# EasyEDA Pro project CALU_BMS_V1.3.0.0.epro, board PCB2
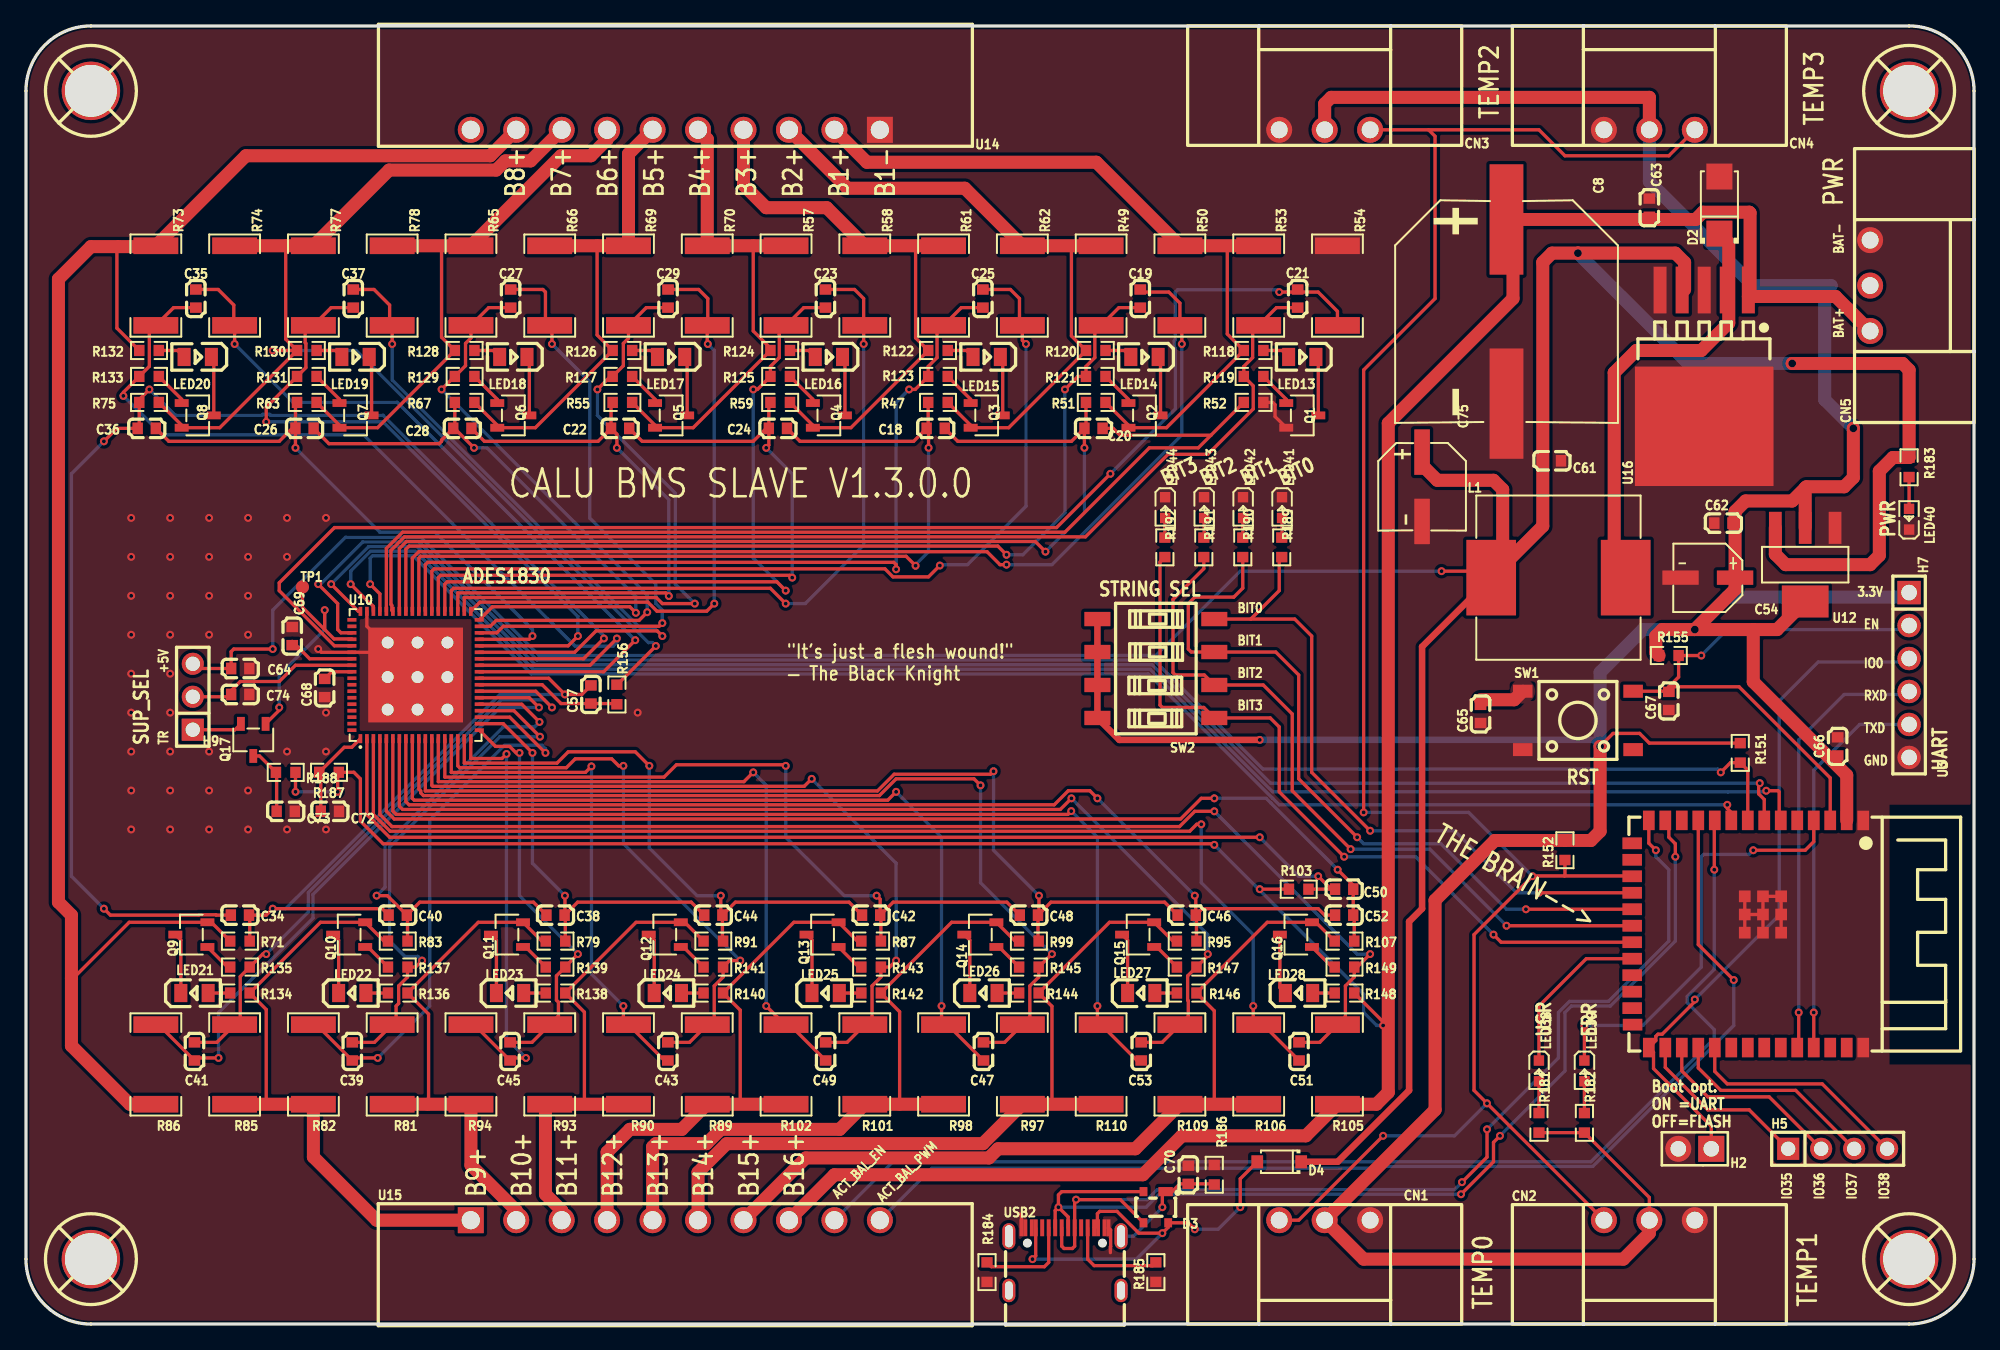
[diagram p19: board, top side]
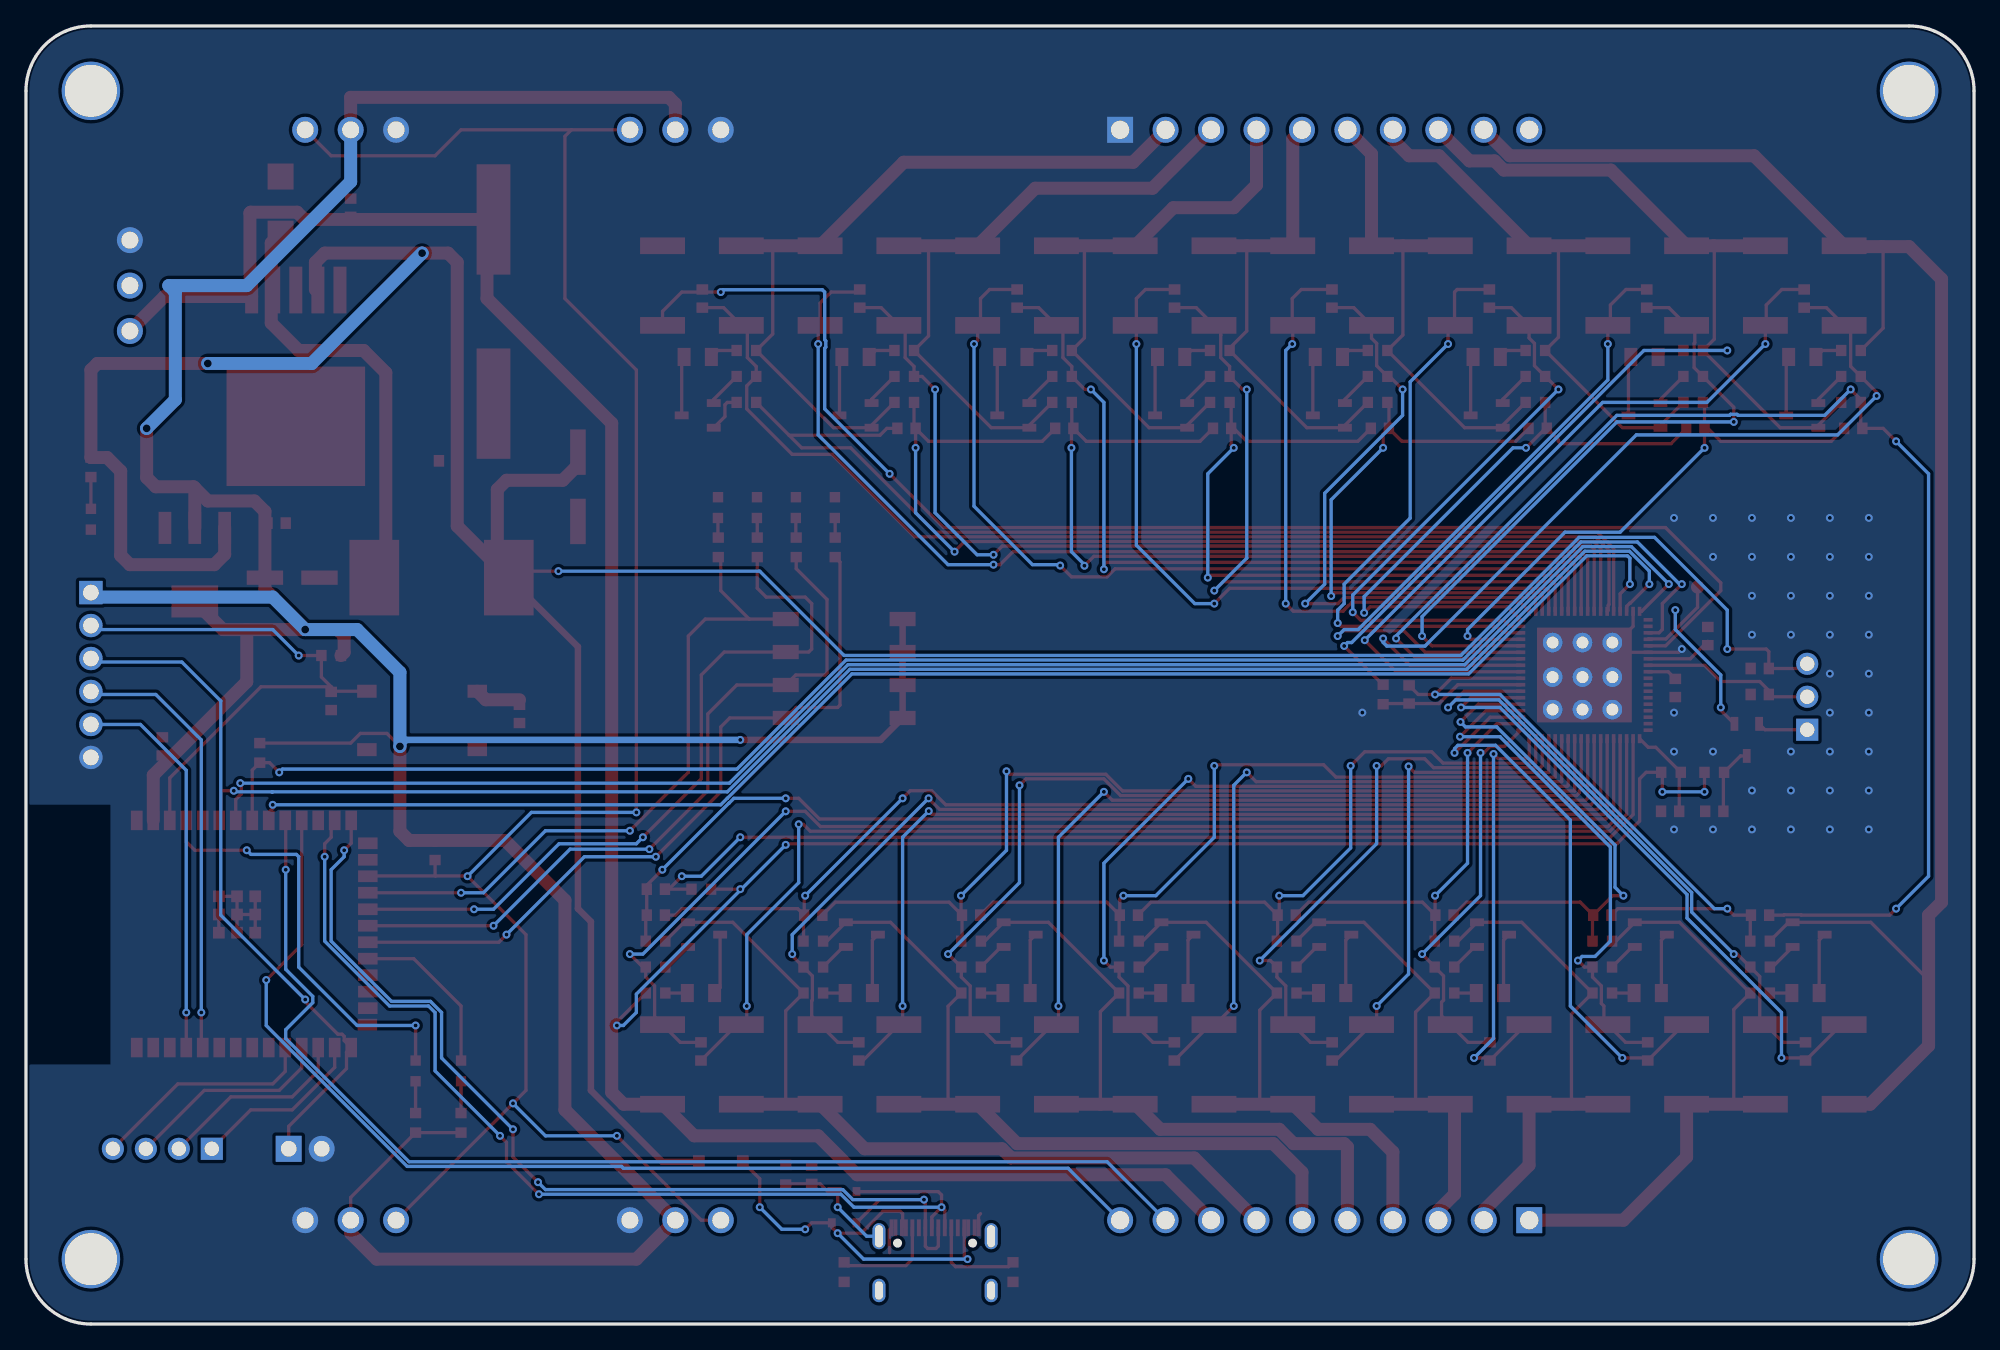
[diagram p20: board, bottom side, seen from below]

Outline 150 x 100 mm; copper layers: Top Layer, Bottom Layer. Coordinates in mm from the lower left corner of the outline.
Outline path: 0,95 0,5 arc(1.46,1.46) 5,0 145,0 arc(148.54,1.46) 150,5 150,95 arc(148.54,98.54) 145,100 5,100 arc(1.46,98.54) 0,95
Stack: Top Layer 0.035mm / Dielectric1 1.51mm FR4 er 4.5 / Bottom Layer 0.035mm

## Design rules (mm)
template: Custom Config
spacing copperThickness1oz (default): track to track 0.102, other pairs 0.152 to 0.3
spacing copperThickness2oz: track to track 0.203, other pairs 0.152 to 0.3
track width copperThickness1oz (default): min 0.127, default 0.254, max 2.54
track width copperThickness2oz: min 0.203, default 0.254, max 2.54
differential pair differentialPair (default): width min 0.127, default 0.254, max 2.54; gap min 0.152, default 0.152
via viaSize (default): diameter min 0.5, default 0.61, max 10; hole min 0.3, default 0.305, max 6.3

## Placement (name value [footprint] x y rotation side)
C8  470uF  [CAP-SMD_BD16.0-L17.0-W17.0-FD-LS18.0]  114 78 270 top
C18  10nF  [C0603]  70.05 69 180 top
C19  100nF  [C0603]  85.8 79 270 top
C20  10nF  [C0603]  82.2 69 180 top
C21  100nF  [C0603]  97.92 79 270 top
C22  10nF  [C0603]  45.75 69 180 top
C23  100nF  [C0603]  61.56 79 270 top
C24  10nF  [C0603]  57.9 69 180 top
C25  100nF  [C0603]  73.68 79 270 top
C26  10nF  [C0603]  21.45 69 180 top
C27  100nF  [C0603]  37.32 79 270 top
C28  10nF  [C0603]  33.6 69 180 top
C29  100nF  [C0603]  49.44 79 270 top
C34  10nF  [C0603]  16.47 31.5 0 top
C35  100nF  [C0603]  13.08 79 270 top
C36  10nF  [C0603]  9.3 69 180 top
C37  100nF  [C0603]  25.2 79 270 top
C38  10nF  [C0603]  40.78 31.5 0 top
C39  100nF  [C0603]  25.12 21 90 top
C40  10nF  [C0603]  28.62 31.5 0 top
C41  100nF  [C0603]  12.97 21 90 top
C42  10nF  [C0603]  65.07 31.5 0 top
C43  100nF  [C0603]  49.42 21 90 top
C44  10nF  [C0603]  52.92 31.5 0 top
C45  100nF  [C0603]  37.28 21 90 top
C46  10nF  [C0603]  89.38 31.5 0 top
C47  100nF  [C0603]  73.72 21 90 top
C48  10nF  [C0603]  77.22 31.5 0 top
C49  100nF  [C0603]  61.57 21 90 top
C50  10nF  [C0603]  101.5 33.5 180 top
C51  100nF  [C0603]  98.03 21 90 top
C52  10nF  [C0603]  101.5 31.5 0 top
C53  100nF  [C0603]  85.88 21 90 top
C54  22uF  [CAP-SMD_BD5.0-L5.3-W5.3-LS6.0-FD]  129.5 57.5 180 top
C57  10nF  [C0603]  43.5 48.5 270 top
C61  100nF  [C0603]  117.5 66.5 180 top
C62  100nF  [C0603]  130.7 61.7 0 top
C63  100nF  [C0603]  125 86 270 top
C64  100nF  [C0603]  16.5 50.5 180 top
C65  100nF  [C0603]  112 47 90 top
C66  100nF  [C0603]  139.5 44.5 270 top
C67  1uF  [C0603]  126.5 48 90 top
C68  1uF  [C0603]  23 49 90 top
C69  1uF  [C0603]  20.5 53 270 top
C70  4.7nF  [C0603]  89.5 11.5 90 top
C72  10nF  [C0603]  23.4 39.5 180 top
C73  10nF  [C0603]  20 39.5 180 top
C74  1uF  [C0603]  16.5 48.5 180 top
C75  470uF  [CAP-SMD_BD6.3-L6.6-W6.6-LS7.6-RD]  107.5 64.5 270 top
CN1  TEMP0  [CONN-TH_3P-P3.50_MAX_MX15EDGRM-3.5-GN01-03P-CU-A]  100 8 0 top
CN2  TEMP1  [CONN-TH_3P-P3.50_MAX_MX15EDGRM-3.5-GN01-03P-CU-A]  125 8 0 top
CN3  TEMP2  [CONN-TH_3P-P3.50_MAX_MX15EDGRM-3.5-GN01-03P-CU-A]  100 92 180 top
CN4  TEMP3  [CONN-TH_3P-P3.50_MAX_MX15EDGRM-3.5-GN01-03P-CU-A]  125 92 180 top
CN5  PWR  [CONN-TH_3P-P3.50_MAX_MX15EDGRM-3.5-GN01-03P-CU-A]  142 80 90 top
D2  SS34  [SMA_L4.3-W2.6-LS5.2-RD]  130.39 86.2 90 top
D3  PRTR5V0U2X  [SOT-143_L2.9-W1.3-P1.92-LS2.3-BL]  87 9 180 top
D4  PMEG6020AELRX  [SOD-123_L2.6-W1.7-LS3.5-RD]  96.5 12.5 180 top
H2  Boot Opt.  [HDR-TH_2P-P2.54-V-M]  128.5 13.5 180 top
H5  IO_B1  [HDR-TH_4P-P2.54-V-M]  139.5 13.5 0 top
H7  PROG  [HDR-TH_6P-P2.54-V-M-1]  145 50 270 top
H9  ADES_SUP  [HDR-TH_3P-P2.54-V-M]  12.84 48.32 90 top
L1  68uH  [IND-SMD_L12.5-W12.5]  118 57.5 0 top
LED13  NCD0805G1  [LED0805-R-RD]  98.28 74.5 180 top
LED14  NCD0805G1  [LED0805-R-RD]  86.12 74.5 180 top
LED15  NCD0805G1  [LED0805-R-RD]  73.97 74.5 180 top
LED16  NCD0805G1  [LED0805-R-RD]  61.82 74.5 180 top
LED17  NCD0805G1  [LED0805-R-RD]  49.67 74.5 180 top
LED18  NCD0805G1  [LED0805-R-RD]  37.53 74.5 180 top
LED19  NCD0805G1  [LED0805-R-RD]  25.38 74.5 180 top
LED20  NCD0805G1  [LED0805-R-RD]  13.22 74.5 180 top
LED21  NCD0805G1  [LED0805-R-RD]  12.97 25.5 0 top
LED22  NCD0805G1  [LED0805-R-RD]  25.12 25.5 0 top
LED23  NCD0805G1  [LED0805-R-RD]  37.28 25.5 0 top
LED24  NCD0805G1  [LED0805-R-RD]  49.42 25.5 0 top
LED25  NCD0805G1  [LED0805-R-RD]  61.57 25.5 0 top
LED26  NCD0805G1  [LED0805-R-RD]  73.72 25.5 0 top
LED27  NCD0805G1  [LED0805-R-RD]  85.88 25.5 0 top
LED28  NCD0805G1  [LED0805-R-RD]  98.03 25.5 0 top
LED38  LED_USR  [LED0603-RD-YELLOW]  116.5 19.5 270 top
LED39  LED_ERR  [LED0603-RD_RED]  120 19.5 270 top
LED40  LED_USR  [LED0603-RD-YELLOW]  145 62 90 top
LED41  STR_SEL_0  [LED0603-RD-YELLOW]  96.72 62.9 270 top
LED42  STR_SEL_1  [LED0603-RD-YELLOW]  93.72 62.9 270 top
LED43  STR_SEL_2  [LED0603-RD-YELLOW]  90.72 62.9 270 top
LED44  STR_SEL_3  [LED0603-RD-YELLOW]  87.72 62.9 270 top
NOREF  -  [Pad_e13402]  27.85 49.84 0 top
NOREF#2  -  [Pad_e13398]  30.15 52.5 0 top
NOREF#3  -  [Pad_e13400]  32.45 49.84 0 top
NOREF#4  -  [Pad_e13404]  30.15 47.34 0 top
NOREF#5  -  [Pad_e13403]  32.45 47.34 0 top
NOREF#6  -  [Pad_e13405]  27.85 47.34 0 top
NOREF#7  -  [Pad_e13389]  27.85 52.5 0 top
NOREF#8  -  [Pad_e13401]  30.15 49.84 0 top
NOREF#9  -  [Pad_e13399]  32.45 52.5 0 top
Q1  S8050  [SOT-23-3_L2.9-W1.6-P1.90-LS2.8-BR]  98.28 70 180 top
Q2  S8050  [SOT-23-3_L2.9-W1.6-P1.90-LS2.8-BR]  86.12 70 180 top
Q3  S8050  [SOT-23-3_L2.9-W1.6-P1.90-LS2.8-BR]  73.97 70 180 top
Q4  S8050  [SOT-23-3_L2.9-W1.6-P1.90-LS2.8-BR]  61.82 70 180 top
Q5  S8050  [SOT-23-3_L2.9-W1.6-P1.90-LS2.8-BR]  49.67 70 180 top
Q6  S8050  [SOT-23-3_L2.9-W1.6-P1.90-LS2.8-BR]  37.53 70 180 top
Q7  S8050  [SOT-23-3_L2.9-W1.6-P1.90-LS2.8-BR]  25.38 70 180 top
Q8  S8050  [SOT-23-3_L2.9-W1.6-P1.90-LS2.8-BR]  13.22 70 180 top
Q9  S8050  [SOT-23-3_L2.9-W1.6-P1.90-LS2.8-BR]  12.74 30 0 top
Q10  S8050  [SOT-23-3_L2.9-W1.6-P1.90-LS2.8-BR]  24.89 30 0 top
Q11  S8050  [SOT-23-3_L2.9-W1.6-P1.90-LS2.8-BR]  37.04 30 0 top
Q12  S8050  [SOT-23-3_L2.9-W1.6-P1.90-LS2.8-BR]  49.19 30 0 top
Q13  S8050  [SOT-23-3_L2.9-W1.6-P1.90-LS2.8-BR]  61.34 30 0 top
Q14  S8050  [SOT-23-3_L2.9-W1.6-P1.90-LS2.8-BR]  73.49 30 0 top
Q15  S8050  [SOT-23-3_L2.9-W1.6-P1.90-LS2.8-BR]  85.64 30 0 top
Q16  S8050  [SOT-23-3_L2.9-W1.6-P1.90-LS2.8-BR]  97.79 30 0 top
Q17  S8050  [SOT-23-3_L2.9-W1.6-P1.90-LS2.8-BR]  17.5 45 90 top
R47  200Ω  [R0603]  70.22 71 180 top
R49  10Ω  [R2512]  82.79 80 270 top
R50  10Ω  [R2512]  88.85 80 270 top
R51  200Ω  [R0603]  82.38 71 180 top
R52  200Ω  [R0603]  94.53 71 180 top
R53  10Ω  [R2512]  94.92 80 270 top
R54  10Ω  [R2512]  100.98 80 270 top
R55  200Ω  [R0603]  45.92 71 180 top
R57  10Ω  [R2512]  58.52 80 270 top
R58  10Ω  [R2512]  64.59 80 270 top
R59  200Ω  [R0603]  58.07 71 180 top
R61  10Ω  [R2512]  70.66 80 270 top
R62  10Ω  [R2512]  76.72 80 270 top
R63  200Ω  [R0603]  21.62 71 180 top
R65  10Ω  [R2512]  34.26 80 270 top
R66  10Ω  [R2512]  40.33 80 270 top
R67  200Ω  [R0603]  33.78 71 180 top
R69  10Ω  [R2512]  46.39 80 270 top
R70  10Ω  [R2512]  52.46 80 270 top
R71  200Ω  [R0603]  16.47 29.5 0 top
R73  10Ω  [R2512]  10 80 270 top
R74  10Ω  [R2512]  16.07 80 270 top
R75  200Ω  [R0603]  9.47 71 180 top
R77  10Ω  [R2512]  22.13 80 270 top
R78  10Ω  [R2512]  28.2 80 270 top
R79  200Ω  [R0603]  40.78 29.5 0 top
R81  10Ω  [R2512]  28.2 20 90 top
R82  10Ω  [R2512]  22.13 20 90 top
R83  200Ω  [R0603]  28.62 29.5 0 top
R85  10Ω  [R2512]  16.07 20 90 top
R86  10Ω  [R2512]  10 20 90 top
R87  200Ω  [R0603]  65.07 29.5 0 top
R89  10Ω  [R2512]  52.46 20 90 top
R90  10Ω  [R2512]  46.39 20 90 top
R91  200Ω  [R0603]  52.92 29.5 0 top
R93  10Ω  [R2512]  40.33 20 90 top
R94  10Ω  [R2512]  34.26 20 90 top
R95  200Ω  [R0603]  89.38 29.5 0 top
R97  10Ω  [R2512]  76.72 20 90 top
R98  10Ω  [R2512]  70.66 20 90 top
R99  200Ω  [R0603]  77.22 29.5 0 top
R101  10Ω  [R2512]  64.59 20 90 top
R102  10Ω  [R2512]  58.52 20 90 top
R103  200Ω  [R0603]  98 33.5 0 top
R105  10Ω  [R2512]  100.98 20 90 top
R106  10Ω  [R2512]  94.92 20 90 top
R107  200Ω  [R0603]  101.53 29.5 0 top
R109  10Ω  [R2512]  88.85 20 90 top
R110  10Ω  [R2512]  82.79 20 90 top
R118  68Ω  [R0603]  94.53 75 180 top
R119  1kΩ  [R0603]  94.53 73 180 top
R120  68Ω  [R0603]  82.38 75 180 top
R121  1kΩ  [R0603]  82.38 73 180 top
R122  68Ω  [R0603]  70.22 75 180 top
R123  1kΩ  [R0603]  70.22 73 180 top
R124  68Ω  [R0603]  58.07 75 180 top
R125  1kΩ  [R0603]  58.07 73 180 top
R126  68Ω  [R0603]  45.92 75 180 top
R127  1kΩ  [R0603]  45.92 73 180 top
R128  68Ω  [R0603]  33.78 75 180 top
R129  1kΩ  [R0603]  33.78 73 180 top
R130  68Ω  [R0603]  21.62 75 180 top
R131  1kΩ  [R0603]  21.62 73 180 top
R132  68Ω  [R0603]  9.47 75 180 top
R133  1kΩ  [R0603]  9.47 73 180 top
R134  68Ω  [R0603]  16.47 25.5 0 top
R135  1kΩ  [R0603]  16.47 27.5 0 top
R136  68Ω  [R0603]  28.62 25.5 0 top
R137  1kΩ  [R0603]  28.62 27.5 0 top
R138  68Ω  [R0603]  40.78 25.5 0 top
R139  1kΩ  [R0603]  40.78 27.5 0 top
R140  68Ω  [R0603]  52.92 25.5 0 top
R141  1kΩ  [R0603]  52.92 27.5 0 top
R142  68Ω  [R0603]  65.07 25.5 0 top
R143  1kΩ  [R0603]  65.07 27.5 0 top
R144  68Ω  [R0603]  77.22 25.5 0 top
R145  1kΩ  [R0603]  77.22 27.5 0 top
R146  68Ω  [R0603]  89.38 25.5 0 top
R147  1kΩ  [R0603]  89.38 27.5 0 top
R148  68Ω  [R0603]  101.53 25.5 0 top
R149  1kΩ  [R0603]  101.53 27.5 0 top
R151  1kΩ  [R0603]  132 44 90 top
R152  4.7kΩ  [R0603]  118.5 36.5 90 top
R155  10kΩ  [R0603]  126.5 51.5 180 top
R156  200Ω  [R0603]  45.5 48.5 270 top
R181  390Ω  [R0603]  116.5 15.5 270 top
R182  820Ω  [R0603]  120 15.5 270 top
R183  1.2kΩ  [R0603]  145 66 90 top
R184  5.1kΩ  [R0603]  74 4 90 top
R185  5.1kΩ  [R0603]  87 4 90 top
R186  1MΩ  [R0603]  91.5 11.5 270 top
R187  1kΩ  [R0603]  23.33 42.51 0 top
R188  330Ω  [R0603]  20 42.5 180 top
R189  390Ω  [R0603]  96.69 59.83 270 top
R190  390Ω  [R0603]  93.69 59.83 270 top
R191  390Ω  [R0603]  90.69 59.83 270 top
R192  390Ω  [R0603]  87.69 59.83 270 top
SCREW1  -  [Screw-Hole-M4]  5 5 0 top
SCREW2  -  [Screw-Hole-M4]  145 5 0 top
SCREW3  -  [Screw-Hole-M4]  145 95 0 top
SCREW4  -  [Screw-Hole-M4]  5 95 0 top
SW1  Reboot  [SW-SMD_4P-L6.0-W6.0-P4.50-LS9.0-H2.5]  119.5 46.5 0 top
SW2  STR_NR  [SW-SMD_8P-L10.2-W6.2-P2.54-LS9.4]  87 50.5 0 top
TP1  -  [Test-Point-0.5mm]  21.29 56.78 0 top
U3  ESP32-S3-WROOM-1-N8R8  [WIRELM-SMD_ESP32-S3-WROOM-1]  132.57 30.05 270 top
U10  ADES1830CCSZ  [LFCSP-72_L10.0-W10.0-P0.50-BL-EP7.3]  30 50 0 top
U12  AMS1117-3.3  [SOT-223-4_L6.5-W3.5-P2.30-LS7.0-BR]  137 58.5 90 top
U14  BATT_0  [CONN-TH_10P-P3.50_MX15EDGRM-3.5-10P-GN01-CU-A]  50 92 180 top
U15  BATT_1  [CONN-TH_10P-P3.50_MX15EDGRM-3.5-10P-GN01-CU-A]  50 8 0 top
U16  LM2596HVS-5.0/TR  [TO-263-5_L10.2-W8.9-P1.70-LS15.2-BR]  129.22 74.41 90 top
USB2  -  [USB-C-SMD_KH-TYPE-C-16P]  80 5 0 top

## Footprints (pads in the part's own frame, mm; a bottom-side part is the same pattern mirrored in y, then rotated)
C0603
  rect 0.8x0.9 smd: 1(-0.7,0) 2(0.7,0)
CAP-SMD_BD5.0-L5.3-W5.3-LS6.0-FD
  rect 2.8x1.1 smd: 1(-2.1,0) 2(2.1,0)
CAP-SMD_BD6.3-L6.6-W6.6-LS7.6-RD
  rect 3.5x1.2 smd: 1(-2.67,0) 2(2.67,0)
CAP-SMD_BD16.0-L17.0-W17.0-FD-LS18.0
  rect 8.5x2.6 smd: 1(-7.093,0) 2(7.093,0)
CONN-TH_3P-P3.50_MAX_MX15EDGRM-3.5-GN01-03P-CU-A
  round 2 hole 1.3: 1(-3.5,0) 2(0,0) 3(3.5,0)
CONN-TH_10P-P3.50_MX15EDGRM-3.5-10P-GN01-CU-A
  rect 2x2 hole 1.4: 1(-15.75,0.001)
  round 2 hole 1.4: 2(-12.25,-0.001) 3(-8.75,-0.001) 4(-5.25,-0.001) 5(-1.75,-0.001) 6(1.75,-0.001) 7(5.25,-0.001) 8(8.75,-0.001) 9(12.25,-0.001) 10(15.75,-0.001)
HDR-TH_2P-P2.54-V-M
  rect 2x2 hole 1.2: 1(-1.27,0)
  round 2 hole 1.2: 2(1.27,0)
HDR-TH_3P-P2.54-V-M
  rect 1.7x1.7 hole 1.1: 1(-2.54,0)
  round 1.7 hole 1.1: 2(0,0) 3(2.54,0)
HDR-TH_4P-P2.54-V-M
  rect 1.7x1.7 hole 1.1: 1(-3.81,0)
  round 1.7 hole 1.1: 2(-1.27,0) 3(1.27,0) 4(3.81,0)
HDR-TH_6P-P2.54-V-M-1
  rect 1.8x1.8 hole 1.2: 1(-6.35,0)
  round 1.8 hole 1.2: 2(-3.81,0) 3(-1.27,0) 4(1.27,0) 5(3.81,0) 6(6.35,0)
IND-SMD_L12.5-W12.5
  rect 3.824x5.82 smd: 1(5.178,0) 2(-5.178,0)
LED0603-RD-YELLOW
  rect 0.8x0.8 smd: 1(-0.799,-0.004) 2(0.799,0.004)
LED0603-RD_RED
  rect 0.8x0.8 smd: 1(-0.799,-0.004) 2(0.799,0.004)
LED0805-R-RD
  rect 1x1.399 smd: 1(1.05,0) 2(-1.05,0)
LFCSP-72_L10.0-W10.0-P0.50-BL-EP7.3
  rect 0.28x0.697 smd: 1(-4.25,-4.904) 2(-3.75,-4.904) 3(-3.25,-4.904) 4(-2.75,-4.904) 5(-2.25,-4.904) 6(-1.75,-4.904) 7(-1.25,-4.904) 8(-0.75,-4.904) 9(-0.25,-4.904) 10(0.25,-4.904) 11(0.75,-4.904) 12(1.25,-4.904) 13(1.75,-4.904) 14(2.25,-4.904) 15(2.75,-4.904) 16(3.25,-4.904) 17(3.75,-4.904) 18(4.25,-4.904) 37(4.25,4.904) 38(3.75,4.904) 39(3.25,4.904) 40(2.75,4.904) 41(2.25,4.904) 42(1.75,4.904) 43(1.25,4.904) 44(0.75,4.904) 45(0.25,4.904) 46(-0.25,4.904) 47(-0.75,4.904) 48(-1.25,4.904) 49(-1.75,4.904) 50(-2.25,4.904) 51(-2.75,4.904) 52(-3.25,4.904) 53(-3.75,4.904) 54(-4.25,4.904)
  rect 0.697x0.28 smd: 19(4.904,-4.25) 20(4.904,-3.75) 21(4.904,-3.25) 22(4.904,-2.75) 23(4.904,-2.25) 24(4.904,-1.75) 25(4.904,-1.25) 26(4.904,-0.75) 27(4.904,-0.25) 28(4.904,0.25) 29(4.904,0.75) 30(4.904,1.25) 31(4.904,1.75) 32(4.904,2.25) 33(4.904,2.75) 34(4.904,3.25) 35(4.904,3.75) 36(4.904,4.25) 55(-4.904,4.25) 56(-4.904,3.75) 57(-4.904,3.25) 58(-4.904,2.75) 59(-4.904,2.25) 60(-4.904,1.75) 61(-4.904,1.25) 62(-4.904,0.75) 63(-4.904,0.25) 64(-4.904,-0.25) 65(-4.904,-0.75) 66(-4.904,-1.25) 67(-4.904,-1.75) 68(-4.904,-2.25) 69(-4.904,-2.75) 70(-4.904,-3.25) 71(-4.904,-3.75) 72(-4.904,-4.25)
  rect 7.3x7.3 smd: 73(0,0)
Pad_e13389
  round 1.524 hole 0.914: 1(0,0)
Pad_e13398
  round 1.524 hole 0.914: 1(0,0)
Pad_e13399
  round 1.524 hole 0.914: 1(0,0)
Pad_e13400
  round 1.524 hole 0.914: 1(0,0)
Pad_e13401
  round 1.524 hole 0.914: 1(0,0)
Pad_e13402
  round 1.524 hole 0.914: 1(0,0)
Pad_e13403
  round 1.524 hole 0.914: 1(0,0)
Pad_e13404
  round 1.524 hole 0.914: 1(0,0)
Pad_e13405
  round 1.524 hole 0.914: 1(0,0)
R0603
  rect 0.806x0.864 smd: 1(-0.753,0) 2(0.753,0)
R2512
  rect 1.282x3.456 smd: 1(-3.067,0) 2(3.067,0)
Screw-Hole-M4
  round 4.5 hole 4: 1(0,0)
SMA_L4.3-W2.6-LS5.2-RD
  rect 2x2 smd: 1(-2.2,0) 2(2.2,0)
SOD-123_L2.6-W1.7-LS3.5-RD
  rect 0.9x1 smd: 1(-1.692,0) 2(1.692,0)
SOT-23-3_L2.9-W1.6-P1.90-LS2.8-BR
  rect 1.07x0.6 smd: 1(1.235,-0.95) 2(1.235,0.95) 3(-1.235,0)
SOT-143_L2.9-W1.3-P1.92-LS2.3-BL
  rect 1.1x0.7 smd: 1(-0.75,-1.2)
  rect 0.6x0.7 smd: 2(0.95,-1.2) 3(0.95,1.2) 4(-0.95,1.2)
SOT-223-4_L6.5-W3.5-P2.30-LS7.0-BR
  rect 2.47x0.98 smd: 1(2.835,-2.3) 2(2.835,0) 3(2.835,2.3)
  rect 2.47x3.6 smd: 4(-2.835,0)
SW-SMD_4P-L6.0-W6.0-P4.50-LS9.0-H2.5
  rect 1.5x1 smd: 1(-4.25,2.25) 2(4.25,2.25) 3(-4.25,-2.25) 4(4.25,-2.25)
SW-SMD_8P-L10.2-W6.2-P2.54-LS9.4
  rect 2x1.1 smd: 1(-4.5,3.81) 2(-4.5,1.27) 3(-4.5,-1.27) 4(-4.5,-3.81) 5(4.5,-3.81) 6(4.5,-1.27) 7(4.5,1.27) 8(4.5,3.81)
Test-Point-0.5mm
  round 1.016 smd: 1(0,0)
TO-263-5_L10.2-W8.9-P1.70-LS15.2-BR
  rect 3.6x1 smd: 1(5.25,-3.4) 2(5.25,-1.7) 3(5.25,0) 4(5.25,1.7) 5(5.25,3.4)
  rect 9.2x10.668 smd: 6(-5.25,0)
USB-C-SMD_KH-TYPE-C-16P
  oval 1x2 hole 0.6x1.7: 1(-4.32,1.765) 2(4.32,1.765)
  oval 1x1.8 hole 0.6x1.4: 3(-4.32,-2.415) 4(4.32,-2.415)
  rect 0.3x1.3 smd: A1(-3.35,2.415) A4(-2.55,2.415) A5(-1.25,2.415) A6(-0.25,2.415) A7(0.25,2.415) A8(1.25,2.415) A9(2.55,2.415) A12(3.35,2.415) B1(3.05,2.415) B4(2.25,2.415) B5(1.75,2.415) B6(0.75,2.415) B7(-0.75,2.415) B8(-1.75,2.415) B9(-2.25,2.415) B12(-3.05,2.415)
WIRELM-SMD_ESP32-S3-WROOM-1
  rect 1.5x0.9 smd: 1(-8.75,8.895) 2(-8.75,7.625) 3(-8.75,6.355) 4(-8.75,5.085) 5(-8.75,3.815) 6(-8.75,2.545) 7(-8.75,1.275) 8(-8.75,0.005) 9(-8.75,-1.265) 10(-8.75,-2.535) 11(-8.75,-3.805) 12(-8.75,-5.075) 13(-8.75,-6.345) 14(-8.75,-7.615) 27(8.75,-7.615) 28(8.75,-6.345) 29(8.75,-5.075) 30(8.75,-3.805) 31(8.75,-2.535) 32(8.75,-1.265) 33(8.75,0.005) 34(8.75,1.275) 35(8.75,2.545) 36(8.75,3.815) 37(8.75,5.085) 38(8.75,6.355) 39(8.75,7.625) 40(8.75,8.895)
  rect 0.9x1.5 smd: 15(-6.985,-8.895) 16(-5.715,-8.895) 17(-4.445,-8.895) 18(-3.175,-8.895) 19(-1.905,-8.895) 20(-0.635,-8.895) 21(0.635,-8.895) 22(1.905,-8.895) 23(3.175,-8.895) 24(4.445,-8.895) 25(5.715,-8.895) 26(6.985,-8.865)
  rect 0.9x0.9 smd: 41(-2.9,2.575) 41(-2.9,1.175) 41(-2.9,-0.225) 41(-1.5,2.575) 41(-1.5,1.175) 41(-1.5,-0.225) 41(-0.1,2.575) 41(-0.1,1.175) 41(-0.1,-0.225)

## Nets
As in the schematic, except:
GND: C8.2 C54.2 C61.1 C62.1 C63.1 C64.1 C65.1 C66.1 C67.1 C68.1 C69.1 C70.2 C72.1 C73.1 C74.1 C75.2 CN1.3 CN2.3 CN3.3 CN4.3 CN5.3 D2.2 H2.2 H7.6 LED40.1 LED41.1 LED42.1 LED43.1 LED44.1 NOREF.1 NOREF#2.1 NOREF#3.1 NOREF#4.1 NOREF#5.1 NOREF#6.1 NOREF#7.1 NOREF#8.1 NOREF#9.1 Q1.2 R52.1 R54.1 R184.1 R185.1 R186.1 SW1.3 U3.1 U3.40 U3.41 U10.53 U10.60 U10.73 U12.1 U14.1 U16.3 U16.5 U16.6 USB2.A1 USB2.A12 USB2.B1 USB2.B12

Pads without a net: CN5 2; SCREW1 1; SCREW2 1; SCREW3 1; SCREW4 1; SW1 4; U3 5 12 15 16 23 24 25 26 32 33 34 35 38 39; U10 55 56 64 65 66 67 68 69 70 71 72; U14 10; USB2 1 3 4 A8 B8

## Via types
v1: diameter 0.61, hole 0.305, Top Layer to Bottom Layer, 190 vias
v2: diameter 1, hole 0.6, Top Layer to Bottom Layer, 5 vias

## Routing (per net, layer and track width the routed paths; a pad name or vN(x,y) marks a point on that pad's centre or on a via; arc(x,y) is an arc through that point)
+5V: length 274.3
  Top Layer w0.254: v1(109,58) 112.32,58 L1.2 ; H9.3 13.21,50.5 C64.2 15.8,51.8 16,52 v1(19,52)
  Top Layer w0.5: D4.1 101,12.5 106.5,18 106.5,31 107.5,32 107.5,52.18 L1.2
  Top Layer w1: C75.1 107.5,66.17 108.67,65 113,65 113.71,64.29 113.71,58.39 116.79,61.47 116.79,81.79 117.5,82.5 v2(119.5,82.5) 127,82.5 127.71,81.79 127.71,79.68 ; U12.3 134.7,59.3 135.5,58.5 142,58.5 142.71,59.21 142.71,65.71 143.75,66.75 R183.2 145,73.5 144.5,74 v2(136,74)
  Bottom Layer w0.254: v1(19,52) 19,55 24.6,60.6 30.41,60.6 39.51,51.51 87.01,51.51 93.5,58 v1(109,58)
  Bottom Layer w1: v2(136,74) 128,74 v2(119.5,82.5)
GND: length 27.3
  Top Layer w0.254: U3.41 U3.41 135.15,32.95 133.75,32.95 U3.41 ; Q1.2 96.18,69.91 96.18,70.82 96,71 R52.1 ; U3.41 U3.41 ; U3.41 U3.41 ; U3.41 132.35,32.95 ; U3.41 U3.41 ; U10.53 26.25,53.75 28.25,51.75 U10.60 22.75,51.75 v1(22.5,52) ; 76.5,8.5 76.65,8.35 USB2.A1 ; 83.5,5.5 83.5,5.96 83.52,5.97 83.52,7.25 USB2.A12
  vias: v1(8.1,62.1) v1(8.1,59.1) v1(8.1,56.1) v1(8.1,53.1) v1(8.1,50.1) v1(8.1,47.1) v1(8.1,44.1) v1(8.1,41.1) v1(8.1,38.1) v1(11.1,62.1) v1(11.1,59.1) v1(11.1,56.1) v1(11.1,53.1) v1(11.1,50.1) v1(11.1,47.1) v1(11.1,44.1) v1(11.1,41.1) v1(11.1,38.1) v1(14.1,62.1) v1(14.1,59.1) v1(14.1,56.1) v1(14.1,53.1) v1(14.1,44.1) v1(14.1,41.1) v1(14.1,38.1) v1(17.1,62.1) v1(17.1,59.1) v1(17.1,56.1) v1(17.1,53.1) v1(17.1,41.1) v1(17.1,38.1) v1(20.1,62.1) v1(20.1,59.1) v1(20.1,44.1) v1(20.1,38.1) v1(23.1,62.1) v1(23.1,47.1) v1(23.1,44.1) v1(23.1,38.1) v1(47.1,47.1)
VBUS: length 31.8
  Top Layer w0.254: USB2.B4 82.5,7.66 82.5,8.5 82.68,8.68 84.01,8.68 85.69,7 v1(87.5,7) 87.95,7.45 D3.4 89.5,7.8 v1(90,7.3) ; v1(93.5,9) 93.5,11.19 D4.2 ; v1(77.5,5) 77.75,5.25 USB2.B9
  Bottom Layer w0.254: v1(90,7.3) 91.8,7.3 v1(93.5,9) ; v1(77.5,5) 85.5,5 v1(87.5,7)
VCC: length 303.3
  Top Layer w0.254: CN2.2 125,9.75 R182.2 R181.2 ; v2(121.21,44.5) 122.21,45.5 124.25,45.5 125,44.75 R151.2
  Top Layer w0.5: v1(95,45) 84.19,45 SW2.4 SW2.3 SW2.2 SW2.1
  Top Layer w1: 133,53.5 133,49.48 140.2,42.28 U3.2 ; 133,53.5 v2(128.5,53.5) ; 133,53.5 134.84,53.5 U12.4 ; v2(128.5,53.5) 126,53.5 125.5,53 125.5,51.75 R155.2 ; v2(128.5,53.5) 131.6,56.6 C54.1 131.6,62.6 132.41,63.41 136,63.41 137,64.41 ; 137,64.41 137.09,64.5 140,64.5 140.71,65.21 v2(140.71,69) ; 137,64.41 U12.2 ; v2(121.21,44.5) 121.21,37.96 120.5,37.25 R152.2 113.1,37.25 108.5,32.65 108.5,16.5 CN1.2 103,5 123,5 125,7 CN2.2 ; CN3.2 100,94 100.5,94.5 125,94.5 CN4.2
  Bottom Layer w0.5: v1(95,45) 120.71,45 v2(121.21,44.5)
  Bottom Layer w1: H7.1 144.65,56 131,56 v2(128.5,53.5) 124.5,53.5 121.21,50.21 v2(121.21,44.5) ; v2(140.71,69) 138.5,71.21 138.5,79.5 139,80 133,80 125,88 CN4.2
ACT_BAL_EN: length 92.1
  Top Layer w0.254: U3.10 130,38.76 v1(130,35)
  Bottom Layer w0.254: U15.9 66.75,12.5 120.5,12.5 130,22 130,22.67 127.92,24.76 127.92,25.24 130,27.33 v1(130,35)
ACT_BAL_PWM: length 88.9
  Top Layer w0.254: v1(131.5,26.5) 128.77,29.23 U3.11
  Bottom Layer w0.254: U15.10 69.75,12 104,12 104.14,12.14 120.65,12.14 131.5,23 v1(131.5,26.5)
B1+: length 58.9
  Top Layer w0.254: R51.1 84.89,69.24 Q2.2 87.82,69.05 R118.2 92.5,76.27 92.5,83
  Top Layer w1: U14.2 64.75,89.5 82.42,89.5 R50.1 R53.1
B2+: length 50.2
  Top Layer w0.254: R47.1 72.74,69.24 Q3.2 75.67,69.05 R120.2 80.5,76.12 80.5,83
  Top Layer w1: U14.3 63.25,87.5 72.29,87.5 R62.1 R49.1
B3+: length 44
  Top Layer w0.254: R59.1 60.59,69.24 Q4.2 63.52,69.05 R122.2 68.5,75.97 68.5,83
  Top Layer w1: R61.1 R58.1 61.66,86 57,86 55.25,87.75 U14.4
B4+: length 37.9
  Top Layer w0.254: 56,83.07 56,76.5 57.32,75.18 R124.2 51.37,69.05 Q5.2 48.44,69.24 R55.1
  Top Layer w1: R57.1 R70.1 52.46,91.29 U14.5
B5+: length 38.4
  Top Layer w0.254: R67.1 36.29,69.24 Q6.2 39.22,69.05 R126.2 43.98,76.19 43.98,83.07
  Top Layer w1: U14.6 46.39,90.14 R69.1 R66.1
B6+: length 43.1
  Top Layer w0.254: 32,83 32,76.02 R128.2 27.07,69.05 Q7.2 24.14,69.24 R63.1
  Top Layer w1: U14.7 44.75,91.25 43.5,90 41.2,90 R65.1 R78.1
B7+: length 96.4
  Top Layer w0.254: R130.2 14.92,69.05 Q8.2 11.99,69.24 R75.1 ; R130.2 v1(19,75) ; R130.2 20,75.87 20,83.02 20.05,83.07 ; v1(48.5,52.24) 45.52,49.25 R156.1
  Top Layer w1: R74.1 R77.1 27.96,88.9 36.21,88.9 36.91,89.61 38.86,89.61 U14.8
  Bottom Layer w0.254: v1(48.5,52.24) 48.24,52.5 47.92,52.5 25.42,75 v1(19,75)
B8+: length 131.6
  Top Layer w0.254: R132.2 7,76.72 7,82.9 7.1,83 ; 3.5,26.64 3.64,26.64 7.95,30.95 Q9.2 14.27,30.95 R71.1 ; 3.5,31.5 3,31.5
  Top Layer w1: R86.1 8,16.93 3.5,21.43 3.5,31.5 2.5,32.5 2.5,80.5 5,83 9.93,83 ; U14.9 35.75,90 16.93,90 R73.1
B9+: length 46.8
  Top Layer w0.254: 18.5,17 18.5,24.23 R134.2 22.68,30.95 Q10.2 27.57,29.5 R83.1
  Top Layer w1: U15.1 27,8 22.13,12.87 R82.1 R85.1
B10+: length 39.2
  Top Layer w0.254: 30.94,16.93 31,16.99 31,23.88 R136.2 34.83,30.95 Q11.2 39.72,29.5 R79.1
  Top Layer w1: R81.1 R94.1 34.26,12.24 37.75,8.75 U15.2
B11+: length 38.3
  Top Layer w0.254: 43,17 43,24.03 R138.2 46.98,30.95 Q12.2 50.72,30.95 R91.1
  Top Layer w1: U15.3 41.25,8.75 40,10 40,16.61 R93.1 R90.1
B12+: length 43.1
  Top Layer w0.254: R87.1 64.02,29.5 Q13.2 59.13,30.95 R140.2 55,24.18 55,17
  Top Layer w1: U15.4 44.75,13.25 46.5,15 50.5,15 52.43,16.93 R89.1 R102.1
B13+: length 52.1
  Top Layer w0.254: 67.27,16.93 67.27,24.06 R142.2 71.28,30.95 Q14.2 76.17,29.5 R99.1
  Top Layer w1: R98.1 R101.1 62.66,15 53.5,15 52.4,13.9 48.5,13.9 48.25,13.65 U15.5
B14+: length 59.3
  Top Layer w0.254: 79,17 79,24.48 R144.2 83.43,30.95 Q15.2 88.32,29.5 R95.1
  Top Layer w1: U15.6 51.75,11.69 53.96,13.9 73.69,13.9 R97.1 R110.1
B15+: length 65.9
  Top Layer w0.254: 91.5,17 91.5,24.13 R146.2 95.58,30.95 99.32,30.95 R107.1
  Top Layer w1: R106.1 R109.1 85.42,13.5 74.85,13.5 74.14,12.8 60.05,12.8 U15.7
B16+: length 260.3
  Top Layer w0.254: v1(24,41) 24,42.42 R187.2 25.24,42.51 25.75,42 25.75,38.75 27.5,37 91.42,37 v1(91.5,36.92) ; R188.1 v1(20.75,41) ; v1(104.5,23) 104.5,23.28 R148.2 ; R103.1 v1(95,33.5)
  Top Layer w1: 132.75,79.74 132.75,85.59 132.69,85.65 129.12,85.65 128.56,85.09 C8.1 114.5,84.59 114.5,79 104.9,69.4 104.9,17.85 103.98,16.93 R105.1 98.55,14.5 89,14.5 86,11.5 62.25,11.5 U15.8 ; CN5.1 139.34,79.16 132.62,79.16
  Bottom Layer w0.254: v1(20.75,41) v1(24,41) ; 94.92,33.5 v1(91.5,36.92) ; 94.92,33.5 v1(95,33.5) ; 94.92,33.5 103,25.42 103,24 104,23 v1(104.5,23)
C0: length 84.1
  Top Layer w0.254: R52.2 91.24,68.47 ; 91.24,68.47 84.24,68.47 83.71,69 C20.1 ; 91.24,68.47 90.27,67.5 86.5,67.5 80,61 29,61 27.75,59.75 U10.50
C1: length 79.5
  Top Layer w0.254: C20.2 80.5,68 71.75,68 C18.1 ; C20.2 v1(81.5,67.5) ; C20.2 81.62,69.12 R51.2 ; v1(78.5,59.5) 77.71,60.29 29.3,60.29 28.75,59.74 U10.48
  Bottom Layer w0.254: v1(78.5,59.5) 81.5,62.5 v1(81.5,67.5)
C2: length 67.4
  Top Layer w0.254: C18.2 69.47,69.12 R47.2 ; C18.2 68.35,68 59.6,68 C24.1 ; C18.2 69.5,68.85 v1(69.5,67.5) ; U10.45 30.25,59 30.39,59.14 67.77,59.14 v1(68.5,58.42)
  Bottom Layer w0.254: v1(69.5,67.5) 69.5,59.5 68.5,58.5 v1(68.5,58.42)
C3: length 56
  Top Layer w0.254: C24.2 57.2,67.7 v1(57,67.5) ; C24.2 57,69 56,68 47.45,68 C22.1 ; C24.2 57.2,70.88 R59.2 ; v1(59,57.5) 58.82,57.68 31.93,57.68 31.75,57.5 U10.42
  Bottom Layer w0.254: v1(59,57.5) 59,65.5 v1(57,67.5)
C4: length 46.2
  Top Layer w0.254: C22.2 44.05,68 35.3,68 C28.1 ; C22.2 45.5,68.55 v1(45.5,67.5) ; C22.2 45.05,70.88 R55.2 ; U10.39 33.25,56.32 49.26,56.32 v1(49.5,56.08)
  Bottom Layer w0.254: v1(49.5,56.08) 49.5,63.5 v1(45.5,67.5)
C5: length 47.2
  Top Layer w0.254: C26.1 23.33,67.82 31.82,67.82 32,68 32,68.1 C28.2 ; v1(46.96,54.79) 46.49,55.26 35.91,55.26 U10.36 ; C28.2 33.02,69.12 R67.2 ; C28.2 33,69 v1(34.5,67.5)
  Bottom Layer w0.254: v1(46.96,54.79) 46.96,56.04 35.5,67.5 v1(34.5,67.5)
C6: length 43.9
  Top Layer w0.254: R63.2 20.75,70.88 C26.2 ; C26.2 20.5,69 19.5,68 11,68 C36.1 ; C26.2 v1(20.75,67.5) ; U10.33 38.75,52.75 v1(39,53)
  Bottom Layer w0.254: v1(20.75,67.5) 27.25,61 31.5,61 39,53.5 v1(39,53)
C7: length 107.8
  Top Layer w0.254: v1(44.5,52.81) 42.94,51.25 U10.30 ; v1(6,32) 6.5,31.5 13.29,31.5 13.32,31.53 14.62,31.53 14.65,31.5 15.78,31.5 ; v1(9.5,72) 8.72,71.22 R75.2 8.72,69.12 C36.2 7,69 v1(6,68)
  Bottom Layer w0.254: v1(6,32) 3.5,34.5 3.5,65.5 v1(6,68) ; v1(44.5,52.81) 44.5,53 27.5,70 18.82,70 18.74,70.08 18.26,70.08 18.18,70 11.5,70 v1(9.5,72)
C8: length 51.9
  Top Layer w0.254: R71.2 17.23,31.45 C34.2 18.5,31.5 v1(19,32) 27.42,32 C40.1 ; U10.27 40.25,49.75 v1(41.5,48.5) 42.8,48.5 C57.1
  Bottom Layer w0.254: v1(41.5,48.5) 36.5,48.5 20,32 v1(19,32)
C9: length 41.7
  Top Layer w0.254: R83.2 29.38,31.45 C40.2 ; v1(39.54,46.38) 38.17,47.75 U10.23 ; C38.1 39.08,32.5 30.33,32.5 C40.2 ; v1(27,33) 27.83,33 C40.2
  Bottom Layer w0.254: v1(27,33) 27.64,33.64 27.64,36.89 36.75,46 39.16,46 v1(39.54,46.38)
C9N: length 11.2
  Top Layer w0.254: R156.2 45.45,47.8 C57.2 41.2,47.8 39.75,49.25 U10.26
C10: length 32.1
  Top Layer w0.254: v1(39,44) 36.75,46.25 U10.20 ; v1(41.5,33) 41.5,31.53 ; 41.5,31.53 42.47,32.5 51.22,32.5 C44.1 ; 41.5,31.53 C38.2 41.53,31.45 R79.2
  Bottom Layer w0.254: v1(41.5,33) 39,35.5 v1(39,44)
C11: length 45.4
  Top Layer w0.254: v1(48,43) 46.92,44.08 41.76,44.08 40.89,43.21 33.75,43.21 U10.17 ; C44.2 54.62,32.5 63.38,32.5 C42.1 ; C44.2 53.62,29.55 R91.2 ; C44.2 53.5,31.62 v1(53.5,33)
  Bottom Layer w0.254: v1(48,43) 48,36.67 51.67,33 v1(53.5,33)
C12: length 59.2
  Top Layer w0.254: C48.1 75.53,32.5 66.78,32.5 65.78,31.5 ; 65.78,31.5 65.83,31.45 R87.2 ; 65.78,31.5 65.78,32.72 v1(65.5,33) ; U10.14 32.25,42.14 49.14,42.14 50.08,43.08 58.42,43.08 v1(58.5,43)
  Bottom Layer w0.254: v1(65.5,33) 63,33 58.5,37.5 v1(58.5,43)
C13: length 74.5
  Top Layer w0.254: v1(74.5,42.58) 74.27,42.36 66.85,42.36 65.56,41.07 30.75,41.07 U10.11 ; v1(78,33) 78,31.57 ; 78,31.57 C48.2 77.93,29.55 R99.2 ; 78,31.57 78.93,32.5 87.68,32.5 C46.1
  Bottom Layer w0.254: v1(78,33) 74.5,36.5 v1(74.5,42.58)
C14: length 84.2
  Top Layer w0.254: C52.1 100,31.5 99.5,32 90.57,32 C46.2 ; U10.8 29.25,40.25 29.5,40 79.17,40 80.26,41.08 81.92,41.08 v1(82.5,40.5) ; C46.2 90.07,32.92 v1(90,33) ; C46.2 90.13,31.45 R95.2
  Bottom Layer w0.254: v1(82.5,40.5) v1(90,33)
C15: length 88.1
  Top Layer w0.254: U10.5 27.75,39.51 28.36,38.91 88.9,38.91 90.5,40.5 v1(91.5,40.5) ; R107.2 102.28,31.42 C52.2 C50.1 102.2,33.8 v1(101,35)
  Bottom Layer w0.254: v1(91.5,40.5) 95.49,40.5 95.85,40.14 95.86,40.14 v1(101,35)
C16: length 84.5
  Top Layer w0.254: 100.5,33.5 C50.2 ; 100.5,33.5 v1(99.5,34.5) ; 100.5,33.5 R103.2 ; v1(95,37.5) 28,37.5 26.25,39.25 U10.2
  Bottom Layer w0.254: v1(99.5,34.5) 98,34.5 v1(95,37.5)
CS: length 118.4
  Top Layer w0.254: U3.9 131.49,38.98 131.49,39.23 131,39.72 v1(131,40) ; U10.51 27.25,56.25 v1(26.5,57)
  Bottom Layer w0.254: v1(26.5,57) 26.5,59 26.68,59.18 29.82,59.18 38.92,50.08 86.41,50.08 95.99,40.5 96,40.5 96.5,40 v1(131,40)
DRIVE: length 18.5
  Top Layer w0.254: TP1.1 21.29,55.21 23,53.5 ; 23,53.5 23.72,52.78 25.07,52.78 U10.58 ; 23,53.5 v1(23,55) ; v1(19.5,47.5) 19.5,47.28 Q17.1
  Bottom Layer w0.254: v1(23,55) 23,53.5 19.5,50 v1(19.5,47.5)
DRIVE_VREG: length 3.9
  Top Layer w0.254: Q17.2 16.1,45.78 H9.1
EN: length 42.9
  Top Layer w0.254: 126.5,49.09 126.16,48.75 SW1.2 ; 126.5,49.09 131.91,49.09 138.93,42.07 U3.3 ; 126.5,49.09 127.25,49.85 R155.1 v1(129,51.5)
  Bottom Layer w0.254: v1(129,51.5) 131,53.5 144.69,53.5 H7.2
IO0: length 52.2
  Top Layer w0.254: v1(128.5,25) 128.5,24.84 125.99,22.33 125.66,22.33 125.5,22.16 125.5,21.84 124.96,21.3 125.32,20.94 125.32,19.68 129.77,15.23 H2.1
  Bottom Layer w0.254: v1(128.5,25) 135,31.5 135,48 138,51 144.73,51 H7.3
IO10: length 52.8
  Top Layer w0.254: 94.31,54.31 97.69,54.31 99,53 99,42.5 v1(103.5,38) ; 94.31,54.31 SW2.8 ; 94.31,54.31 96.5,56.5 96.5,58.89 R189.2 ; U3.18 v1(116.5,33.22)
  Bottom Layer w0.254: v1(103.5,38) 110,38 114.78,33.22 v1(116.5,33.22)
IO11: length 57.7
  Top Layer w0.254: v1(102.5,37.5) 98,42 98,50 96.23,51.77 SW2.7 89.73,51.77 89.5,52 89.5,55.5 90,56 93,56 93.69,56.69 R190.2 ; U3.19 v1(115.5,31.95)
  Bottom Layer w0.254: v1(102.5,37.5) 103,37 108.95,37 114,31.95 v1(115.5,31.95)
IO12: length 56.8
  Top Layer w0.254: v1(102,36.58) 97.5,41.08 97.5,47 95.27,49.23 SW2.6 90.73,50 88.5,50 88.32,50.18 88.32,55.82 90.69,58.19 R191.2 ; U3.20 v1(114,30.68)
  Bottom Layer w0.254: v1(102,36.58) 108.1,36.58 v1(114,30.68)
IO13: length 58.4
  Top Layer w0.254: v1(113,30) 113.59,29.41 U3.21 ; R192.2 87.32,58.71 87.32,47.68 87.5,47.5 90.69,47.5 SW2.5 95.81,46.69 96.5,46 96.5,41 v1(101.5,36)
  Bottom Layer w0.254: v1(101.5,36) 107,36 v1(113,30)
IO35: length 13.6
  Top Layer w0.254: H5.1 132.69,16.5 129.5,16.5 126.23,19.77 126.23,21.3
IO36: length 15
  Top Layer w0.254: H5.2 134.23,17.5 129.5,17.5 127.5,19.5 127.5,21.3
IO37: length 16.1
  Top Layer w0.254: 128.77,21.3 128.77,19.73 130.5,18 136.27,18 H5.3
IO38: length 17.6
  Top Layer w0.254: H5.4 138.31,18.5 131,18.5 130.04,19.46 130.04,21.3
LED_ERR: length 32.6
  Top Layer w0.254: v1(133,36.5) 137,36.5 137.66,37.16 U3.4 ; 120,20.55 v1(120,23)
  Bottom Layer w0.254: v1(120,23) 124.5,23 129,27.5 129,36 129.18,36.18 132.68,36.18 v1(133,36.5)
LED_USR: length 12.9
  Top Layer w0.254: U3.22 120.14,28.14 116.5,24.5 116.5,20.3 LED38.1
MISO: length 128.5
  Top Layer w0.254: U10.57 24.25,53.25 24,53.5 24,55.5 v1(22.5,57) ; U3.8 132.58,42.67 R151.1 131.25,43.25 v1(130.5,42.5)
  Bottom Layer w0.254: v1(130.5,42.5) 130.25,42.75 95.25,42.75 86.85,51.15 39.36,51.15 30.26,60.25 25.92,60.25 22.67,57 v1(22.5,57)
MOSI: length 125
  Top Layer w0.254: v1(133.5,41.67) 133.42,41.58 133.42,40.84 133.85,40.41 U3.7 ; v1(23.5,57) 25.6,54.9 U10.54
  Bottom Layer w0.254: v1(23.5,57) 23.5,57.01 26.38,59.89 30.12,59.89 39.21,50.8 86.7,50.8 95.83,41.67 v1(133.5,41.67)
RXD: length 33.8
  Top Layer w0.254: v1(136.5,24) 136.5,21.41 136.39,21.3
  Bottom Layer w0.254: v1(136.5,24) 136.5,45 140,48.5 144.77,48.5 H7.4
S1N: length 106.1
  Top Layer w0.254: U10.59 23.75,52.25 19.5,56.5 19.5,57.1 23.75,61.36 79.36,61.36 v1(83.5,65.5) ; v1(96.5,79.5) 97.72,79.5 C21.1 98.12,79.5 99.5,79.5 100.98,78.02 R54.2
  Bottom Layer w0.254: v1(96.5,79.5) 96.32,79.68 88.68,79.68 88.5,79.5 88.5,75.83 88.42,75.74 88.42,75.26 88.5,75.17 88.5,70.5 v1(83.5,65.5)
S1P: length 86.4
  Top Layer w0.254: U10.49 28.17,54.98 28.17,55.37 28.11,55.43 28.11,59.6 29.15,60.64 81.58,60.64 87.94,67 91,67 94.5,70.5 94.5,72.27 R119.2 93.77,73.77 94.45,74.45 94.45,76.47 R53.2 96.28,78.3 C21.2
S2N: length 81.8
  Top Layer w0.254: v1(75.5,58.5) 75,58.5 74,59.5 30.25,59.5 29.75,59 U10.46 ; v1(89,75.5) 89,76.79 R50.2 88.85,78.65 88,79.5 86,79.5 C19.1
  Bottom Layer w0.254: v1(89,75.5) 89,68.5 79,58.5 v1(75.5,58.5)
S2P: length 76.8
  Top Layer w0.254: U10.47 29.25,59.68 29.5,59.93 74.83,59.93 v1(75.5,59.26) ; C19.2 84.15,78.3 R49.2 82.3,76.45 82.3,74.45 81.62,73.77 R121.2 81,73 v1(80,72)
  Bottom Layer w0.254: v1(80,72) 80,62.5 76.76,59.26 v1(75.5,59.26)
S3N: length 70.7
  Top Layer w0.254: v1(77,75.5) 76.72,75.78 R62.2 76.5,77.16 76.5,79 75.8,79.7 C25.1 ; U10.43 31.25,58 31.43,58.18 66.14,58.18 66.76,57.56 69.49,57.56 v1(70.37,58.43)
  Bottom Layer w0.254: v1(77,75.5) 77,63 72.5,58.5 70.43,58.5 v1(70.37,58.43)
S3P: length 64.5
  Top Layer w0.254: v1(68,72) 68.47,72 R123.2 69.47,73.77 70.15,74.45 70.15,76.43 R61.2 72.02,78.3 C25.2 ; U10.44 30.75,58.5 30.93,58.68 66.82,58.68 67,58.5 v1(67,58.14)
  Bottom Layer w0.254: v1(67,58.14) 67,71 v1(68,72)
S4N: length 58.1
  Top Layer w0.254: U10.40 32.75,56.5 32.93,56.68 57.32,56.68 v1(58.5,55.5) ; C23.1 63.8,79.7 64.5,79 64.5,77.02 R58.2 64.5,76.84 v1(64.5,75.5)
  Bottom Layer w0.254: v1(58.5,55.5) 60,55.5 64.5,60 v1(64.5,75.5)
S4P: length 54.4
  Top Layer w0.254: 58,76.5 58,76.18 58,76.18 58,74.45 57.32,73.77 R125.2 56.32,72 v1(56,72) ; U10.41 32.25,57 32.43,57.18 57.82,57.18 v1(58.5,56.5) ; C23.2 59.89,78.3 R57.2
  Bottom Layer w0.254: v1(56,72) 56,59 v1(58.5,56.5)
S5N: length 46.7
  Top Layer w0.254: U10.37 34.96,55.61 47.89,55.61 48.58,54.92 52.42,54.92 v1(53,55.5) ; v1(52.5,75.5) 52.46,75.54 R70.2 52.5,76.97 52.5,79 51.8,79.7 C29.1
  Bottom Layer w0.254: v1(53,55.5) 53,75 v1(52.5,75.5)
S5P: length 48.3
  Top Layer w0.254: v1(51.5,55.5) 49,55.5 48.53,55.97 33.75,55.97 U10.38 ; v1(44,72) 45,73 R127.2 46,73.82 46,75.55 46.39,75.94 R69.2 47.76,78.3 C29.2
  Bottom Layer w0.254: v1(51.5,55.5) 50,57 50,64 44,70 v1(44,72)
S6N: length 46.4
  Top Layer w0.254: C27.1 39.8,79.7 40,79.5 40,77.26 R66.2 40.5,76.76 v1(40.5,75.5) ; v1(49,54) 48.75,53.75 36.75,53.75 36.25,53.25 U10.34
  Bottom Layer w0.254: v1(40.5,75.5) 43.42,72.58 43.42,62.08 48.5,57 48.5,55.5 49,55 v1(49,54)
S6P: length 46.6
  Top Layer w0.254: U10.35 35.75,53.75 36.21,54.21 47.21,54.21 v1(47.84,54.84) ; v1(32,72) 33,73 R129.2 33.85,73.82 33.85,75.55 34.26,75.96 R65.2 35.63,78.3 C27.2
  Bottom Layer w0.254: v1(47.84,54.84) 47.84,56.16 v1(32,72)
S7N: length 53.1
  Top Layer w0.254: v1(28.2,75.5) R78.2 28,77.13 28,78.5 26.8,79.7 C37.1 ; U10.31 42.25,51.75 43.9,53.4 48.6,53.4 v1(49,53)
  Bottom Layer w0.254: v1(28.2,75.5) 28.2,72.73 47.42,53.5 48.5,53.5 v1(49,53)
S7P: length 51.5
  Top Layer w0.254: v1(42.5,53) 41.75,52.25 U10.32 ; C37.2 23.5,78.3 R77.2 ; v1(18.5,69.5) 18.5,70.63 R131.2 21.55,73.68 21.55,75.55 21.5,75.6 21.5,76.5
  Bottom Layer w0.254: v1(18.5,69.5) 27.5,69.5 42.5,54.5 v1(42.5,53)
S8N: length 59.8
  Top Layer w0.254: v1(46.91,52.68) 44.48,50.25 U10.28 ; C35.1 14.8,79.7 16,78.5 16,77 R74.2 v1(16.07,75.5)
  Bottom Layer w0.254: v1(16.07,75.5) 20.57,71 28.59,71 v1(46.91,52.68)
S8P: length 67.3
  Top Layer w0.254: R73.2 11.37,78.3 C35.2 ; U10.29 43.44,50.75 v1(45.5,52.81) ; 9.5,76.5 9.5,73.78 R133.2 7.5,71.78 v1(7.5,71.5)
  Bottom Layer w0.254: v1(7.5,71.5) 10.5,68.5 26,68.5 42.27,52.23 45.22,52.23 45.5,52.51 v1(45.5,52.81)
S9N: length 49.9
  Top Layer w0.254: R86.2 10.21,23.07 C41.1 13.17,20.5 v1(14.83,20.5) ; v1(39.5,47.5) 38.75,48.25 U10.24
  Bottom Layer w0.254: v1(14.83,20.5) 14.83,24 22.1,31.27 22.1,33.09 36.5,47.5 v1(39.5,47.5)
S9P: length 47.6
  Top Layer w0.254: v1(40.5,47.5) 39.25,48.75 U10.25 ; C41.2 14.7,21.7 R85.2 16.5,23.5 16.5,26.77 R135.2 18.23,28.5 v1(18.5,28.5)
  Bottom Layer w0.254: v1(18.5,28.5) 21.74,31.74 21.74,33.24 36.58,48.08 39.92,48.08 v1(40.5,47.5)
S10N: length 44.1
  Top Layer w0.254: R82.2 22.36,23.07 C39.1 25.33,20.5 v1(27.08,20.5) ; U10.21 37.25,46.75 v1(40,44)
  Bottom Layer w0.254: v1(40,44) 40,44.33 39.74,44.58 36.84,44.58 31.08,38.83 31.08,24.5 v1(27.08,20.5)
S10P: length 40.9
  Top Layer w0.254: v1(39.58,45.25) 37.58,47.25 U10.22 ; v1(30.5,28) 30,27.5 R137.2 29.38,26.73 28.7,26.05 28.7,24.7 28.5,24.5 28.5,23.37 R81.2 26.83,21.7 C39.2
  Bottom Layer w0.254: v1(39.58,45.25) 36.5,45.25 28,36.75 28,29.5 29.18,28.32 30.18,28.32 v1(30.5,28)
S11N: length 33.9
  Top Layer w0.254: R94.2 34.51,23.07 C45.1 37.47,20.5 v1(38.5,20.5) ; U10.18 34.25,43.57 36.65,43.57 v1(37,43.92)
  Bottom Layer w0.254: v1(38.5,20.5) 37,22 v1(37,43.92)
S11P: length 31.3
  Top Layer w0.254: v1(42.5,28.5) 41.53,27.53 R139.2 40.85,26.82 40.85,24.95 41,24.8 41,23.74 R93.2 38.96,21.7 C45.2 ; U10.19 36.15,44.5 37.24,44.5 37.74,44 v1(38,44)
  Bottom Layer w0.254: v1(38,44) 38,33 v1(42.5,28.5)
S12N: length 38.8
  Top Layer w0.254: v1(46,24.5) 46,23.46 R90.2 49.16,20.3 C43.1 ; v1(43.54,42.96) 43.08,42.5 33.36,42.5 33.36,42.49 32.76,42.49 32.75,42.5 U10.15
  Bottom Layer w0.254: v1(46,24.5) 43.54,26.96 v1(43.54,42.96)
S12P: length 44.2
  Top Layer w0.254: U10.16 33.25,43 33.39,42.86 41.61,42.86 42.3,43.54 45.1,43.54 45.64,43 v1(46,43) ; C43.2 51.09,21.7 R89.2 53,23.6 53,26.05 53.68,26.73 R141.2 54.18,28 v1(55,28)
  Bottom Layer w0.254: v1(55,28) 46,37 v1(46,43)
S13N: length 52.6
  Top Layer w0.254: v1(56,42.5) 55.28,41.78 31.75,41.78 U10.13 ; v1(57,24.5) 58.43,23.07 R102.2 58.81,23.07 C49.1
  Bottom Layer w0.254: v1(57,24.5) 57,41.5 v1(56,42.5)
S13P: length 59.7
  Top Layer w0.254: C49.2 63.22,21.7 R101.2 65.15,23.62 65.15,26.05 65.83,26.73 R143.2 66.5,27.5 v1(67,28) ; v1(60.5,42) 59.92,41.42 31.33,41.42 31.25,41.5 U10.12
  Bottom Layer w0.254: v1(60.5,42) 67,35.5 v1(67,28)
S14N: length 65.8
  Top Layer w0.254: v1(67,41) 66.36,40.36 29.89,40.36 29.75,40.5 U10.9 ; v1(70.5,24.5) 70.5,23.22 R98.2 70.96,23.07 C47.1
  Bottom Layer w0.254: v1(67,41) 70.5,37.5 v1(70.5,24.5)
S14P: length 73.4
  Top Layer w0.254: v1(73.5,41.5) 73,42 67,42 65.71,40.71 30.6,40.71 30.39,40.92 30.39,41.07 30.25,41.21 U10.10 ; C47.2 75.35,21.7 R97.2 77.3,23.64 77.3,26.05 77.98,26.73 R145.2 78.98,28.5 v1(79,28.5)
  Bottom Layer w0.254: v1(73.5,41.5) 73.5,34 v1(79,28.5)
S15N: length 79.7
  Top Layer w0.254: C53.1 85.55,20.3 R110.2 82.5,23.35 v1(82.5,24.5) ; v1(80.48,39.52) 80.23,39.26 28.5,39.26 28.25,39.52 U10.6
  Bottom Layer w0.254: v1(82.5,24.5) 82.5,37.5 v1(80.48,39.52)
S15P: length 83.7
  Top Layer w0.254: v1(80.5,40.5) 79.64,39.64 29,39.64 28.75,39.89 U10.7 ; C53.2 87.49,21.7 R109.2 89.5,23.71 89.5,24.9 89.45,24.95 89.45,26.82 R147.2 91,28.37 v1(91,28.5)
  Bottom Layer w0.254: v1(80.5,40.5) 91,30 v1(91,28.5)
S16N: length 91.9
  Top Layer w0.254: U10.3 26.75,39.25 28.04,37.96 89.61,37.96 90.14,38.5 v1(90.5,38.5) ; C51.1 95.26,23.07 R106.2 94.5,23.48 v1(94.5,24.5)
  Bottom Layer w0.254: v1(90.5,38.5) 90.5,34 94.5,30 v1(94.5,24.5)
S16P: length 97.7
  Top Layer w0.254: U10.4 27.25,39.26 28.19,38.32 88.82,38.32 90,39.5 v1(91.5,39.5) ; v1(103.5,28.5) 102.5,27.5 R149.2 102.28,26.73 101.6,26.05 101.6,23.68 R105.2 99.62,21.7 C51.2
  Bottom Layer w0.254: v1(91.5,39.5) 102.5,28.5 v1(103.5,28.5)
SCLK: length 124.5
  Top Layer w0.254: v1(134,41.08) 134.92,41.08 135,41 135,38.92 U3.6 ; U10.52 26.75,55.29 26.51,55.53 26.47,55.53 v1(25,57)
  Bottom Layer w0.254: 131.06,41 131.04,40.98 131.02,41 ; 131.06,41 133.92,41 v1(134,41.08) ; 131.06,41 131.02,41 ; v1(25,57) 25,58 26.53,59.54 29.97,59.54 39.06,50.44 86.56,50.44 96,41 131.02,41
TEMP_1WIRE: length 157.9
  Top Layer w0.254: CN4.1 126.5,90 118.5,90 116.5,92 108,92 ; U3.17 123.65,34.52 118.46,34.52 ; 108,92 108.5,91.5 108.5,79 103,73.5 v1(103,39.42) ; 108,92 CN3.1 ; 118.46,34.52 116,34.52 v1(116,34.5) 111.5,30 111.5,18 v1(112.5,17) CN2.1 ; 118.46,34.52 118.5,34.56 R152.1 ; CN1.1 98,8 v1(104.5,14.5)
  Bottom Layer w0.254: v1(103,39.42) 111.08,39.42 v1(116,34.5) ; v1(112.5,17) 110,14.5 v1(104.5,14.5)
TXD: length 30.2
  Top Layer w0.254: 137.66,21.3 v1(137.66,24)
  Bottom Layer w0.254: v1(137.66,24) 137.66,42.66 141.19,46.19 H7.5
USB_D+: length 79.3
  Top Layer w0.254: v1(112.5,15) 112.5,12.86 v1(110.57,10.93) ; D3.3 84.27,9.58 v1(80.86,9.58) 80.75,9.48 USB2.B6 80.75,6 80.57,5.82 79.93,5.82 79.75,6 USB2.A6 ; v1(125.5,36.5) 124.96,37.04 U3.14
  Bottom Layer w0.254: v1(80.86,9.58) 86.33,9.58 87.1,10.36 110,10.36 v1(110.57,10.93) ; v1(125.5,36.5) 125.5,36 126.5,35 126.5,29.5 121.85,24.86 118.85,24.86 118,24 118,20.5 v1(112.5,15)
USB_D-: length 80.3
  Top Layer w0.254: v1(79.5,9) 80.25,8.25 USB2.A7 ; v1(79.5,9) 79.5,9.95 79.75,10.2 D3.2 ; v1(79.5,9) 79.25,8.75 USB2.B7 ; U3.13 126.5,38.53 126.5,37.5 127,37 v1(127,36) ; v1(113.5,14.5) 113,14 113,12.5 v1(110.5,10)
  Bottom Layer w0.254: v1(79.5,9) 86.25,9 87.25,10 v1(110.5,10) ; v1(113.5,14.5) 118.5,19.5 118.5,24 119,24.5 122,24.5 127,29.5 v1(127,36)
USB_SH: length 9.4
  Top Layer w0.254: v1(87.5,9) 87.5,9.95 D3.1 88.25,10.2 88.85,10.8 C70.1 91.45,10.8 R186.2
  Bottom Layer w0.254: USB2.2 85.26,6.76 v1(87.5,9)
V+: length 7.3
  Top Layer w0.254: U10.1 25.09,44.43 24.51,44.43 R187.1 22.7,42.39 C72.2
VREG: length 13.4
  Top Layer w0.254: U10.62 20.75,50.75 19.5,49.5 16.5,49.5 15.8,48.8 C74.2 15.62,48.32 H9.2
$1N1698: length 33.7
  Top Layer w1: D2.1 131.11,83.28 131.11,77.11 129,75 124,75 122.29,73.29 122.29,58.39 L1.1
$1N8969: length 3.5
  Top Layer w1: 112,48.09 114.59,48.09 SW1.1
$1N10613: length 2.3
  Top Layer w0.254: C68.2 23.55,50.25 U10.63
$1N10728: length 5.2
  Top Layer w0.254: 20.5,52.59 21.84,51.25 U10.61
$1N25488: length 2.4
  Top Layer w0.254: R181.1 116.5,16.26 LED38.2
$1N25489: length 2.4
  Top Layer w0.254: LED39.2 120,18.7 R182.1
$1N25601: length 2.4
  Top Layer w0.254: R183.1 145,62.8 LED40.2
$1N27362: length 7.7
  Top Layer w0.254: R184.2 74.34,4.42 78.42,4.42 78.75,4.75 USB2.A5
$1N27394: length 8
  Top Layer w0.254: USB2.B5 81.75,5 82.25,4.5 86.75,4.5 R185.2
$1N37570: length 5.3
  Top Layer w0.254: Q17.3 17.98,43.77 R188.2 19.3,42.45 C73.2
$3N538: length 2.8
  Top Layer w0.254: R119.1 97.04,71.24 Q1.1
$3N540: length 4.6
  Top Layer w0.254: Q1.3 99.51,74.31 LED13.2
$3N542: length 2.2
  Top Layer w0.254: LED13.1 96.72,75 R118.1
$3N550: length 2.8
  Top Layer w0.254: R121.1 84.89,71.24 Q2.1
$3N552: length 4.6
  Top Layer w0.254: LED14.2 87.36,74.31 Q2.3
$3N554: length 2.2
  Top Layer w0.254: LED14.1 84.57,75 R120.1
$3N562: length 2.8
  Top Layer w0.254: Q3.1 72.74,71.24 R123.1
$3N564: length 4.6
  Top Layer w0.254: LED15.2 75.21,74.31 Q3.3
$3N566: length 2.2
  Top Layer w0.254: R122.1 72.42,75 LED15.1
$3N1234: length 2.8
  Top Layer w0.254: R125.1 60.59,71.24 Q4.1
$3N1236: length 4.6
  Top Layer w0.254: LED16.2 63.06,74.31 Q4.3
$3N1238: length 2.2
  Top Layer w0.254: R124.1 60.27,75 LED16.1
$3N1246: length 2.8
  Top Layer w0.254: Q5.1 48.44,71.24 R127.1
$3N1248: length 4.6
  Top Layer w0.254: LED17.2 50.91,74.31 Q5.3
$3N1250: length 2.2
  Top Layer w0.254: R126.1 48.12,75 LED17.1
$3N1576: length 2.8
  Top Layer w0.254: R129.1 36.29,71.24 Q6.1
$3N1578: length 4.6
  Top Layer w0.254: LED18.2 38.76,74.31 Q6.3
$3N1580: length 2.2
  Top Layer w0.254: LED18.1 35.97,75 R128.1
$3N1588: length 2.8
  Top Layer w0.254: R131.1 24.14,71.24 Q7.1
$3N1590: length 4.6
  Top Layer w0.254: LED19.2 26.61,74.31 Q7.3
$3N1592: length 2.2
  Top Layer w0.254: LED19.1 23.82,75 R130.1
$3N2713: length 2.8
  Top Layer w0.254: R133.1 11.99,71.24 Q8.1
$3N2715: length 4.6
  Top Layer w0.254: Q8.3 14.46,74.31 LED20.2
$3N2717: length 2.2
  Top Layer w0.254: R132.1 11.67,75 LED20.1
$3N2725: length 2.4
  Top Layer w0.254: R135.1 15.52,27.5 Q9.1
$3N2727: length 4.7
  Top Layer w0.254: Q9.3 11.92,29.58 LED21.2
$3N2729: length 1.7
  Top Layer w0.254: R134.1 LED21.1
$3N2737: length 2.4
  Top Layer w0.254: Q10.1 26.32,29.05 R137.1
$3N2739: length 4.7
  Top Layer w0.254: LED22.2 24.07,29.58 Q10.3
$3N2741: length 1.7
  Top Layer w0.254: R136.1 LED22.1
$3N2749: length 2.4
  Top Layer w0.254: Q11.1 38.47,29.05 R139.1
$3N2751: length 4.7
  Top Layer w0.254: Q11.3 36.22,29.58 LED23.2
$3N2753: length 1.7
  Top Layer w0.254: R138.1 LED23.1
$3N2761: length 2.4
  Top Layer w0.254: Q12.1 50.62,29.05 R141.1
$3N2763: length 4.7
  Top Layer w0.254: LED24.2 48.37,29.58 Q12.3
$3N2765: length 1.7
  Top Layer w0.254: R140.1 LED24.1
$3N2773: length 2.4
  Top Layer w0.254: R143.1 64.12,27.5 Q13.1
$3N2775: length 4.7
  Top Layer w0.254: Q13.3 60.52,29.58 LED25.2
$3N2777: length 1.7
  Top Layer w0.254: R142.1 LED25.1
$3N2785: length 2.4
  Top Layer w0.254: Q14.1 74.92,29.05 R145.1
$3N2787: length 4.7
  Top Layer w0.254: LED26.2 72.67,29.58 72.25,30
$3N2789: length 1.7
  Top Layer w0.254: R144.1 LED26.1
$3N3115: length 2.4
  Top Layer w0.254: R147.1 87.07,29.05 Q15.1
$3N3117: length 4.7
  Top Layer w0.254: LED27.2 84.82,29.58 Q15.3
$3N3119: length 1.7
  Top Layer w0.254: R146.1 LED27.1
$3N3127: length 2.4
  Top Layer w0.254: 99.02,29.05 100.57,27.5 R149.1
$3N3129: length 4.7
  Top Layer w0.254: LED28.2 96.55,25.92 Q16.3
$3N3131: length 1.7
  Top Layer w0.254: R148.1 LED28.1
$3N6113: length 1.5
  Top Layer w0.254: R189.1 96.72,60.61 96.72,62.1
$3N6244: length 1.5
  Top Layer w0.254: 93.72,62.1 93.69,62.07 R190.1
$3N6339: length 1.5
  Top Layer w0.254: R191.1 90.72,60.61 90.72,62.1
$3N6434: length 1.5
  Top Layer w0.254: R192.1 87.69,62.07 87.72,62.1

## Copper pours and planes (outline as drawn; the poured copper is in the pictures)
GND on Top Layer: 0,100 150,100 150,0 0,0
GND on Bottom Layer: 0,100 150,100 150,0 0,0

## Text on the board
Top Silkscreen Layer: ACT_BAL_EN | ACT_BAL_PWM | IO35 | IO36 | BAT- | BAT+ | IO37 | IO38 | BIT0 | BIT1 | BIT2 | BIT3 | 3.3V | EN | IO0 | RXD | TXD | GND | +5V | TR | Boot opt. / ON =UART / OFF=FLASH | USR | ERR | PWR | UART | ADES1830 | STRING SEL | RST | SUP_SEL | B9+ | B10+ | B7+ | B11+ | B6+ | B12+ | B5+ | B13+ | B4+ | B14+ | B3+ | B15+ | B2+ | B16+ | B1+ | B1- | THE BRAIN--> | B8+ | TEMP0 | TEMP2 | TEMP1 | TEMP3 | CALU BMS SLAVE V1.3.0.0 | "It's just a flesh wound!" / — The Black Knight
